# EAGLE design master-board plus slave (EAGLE 9.1.3)
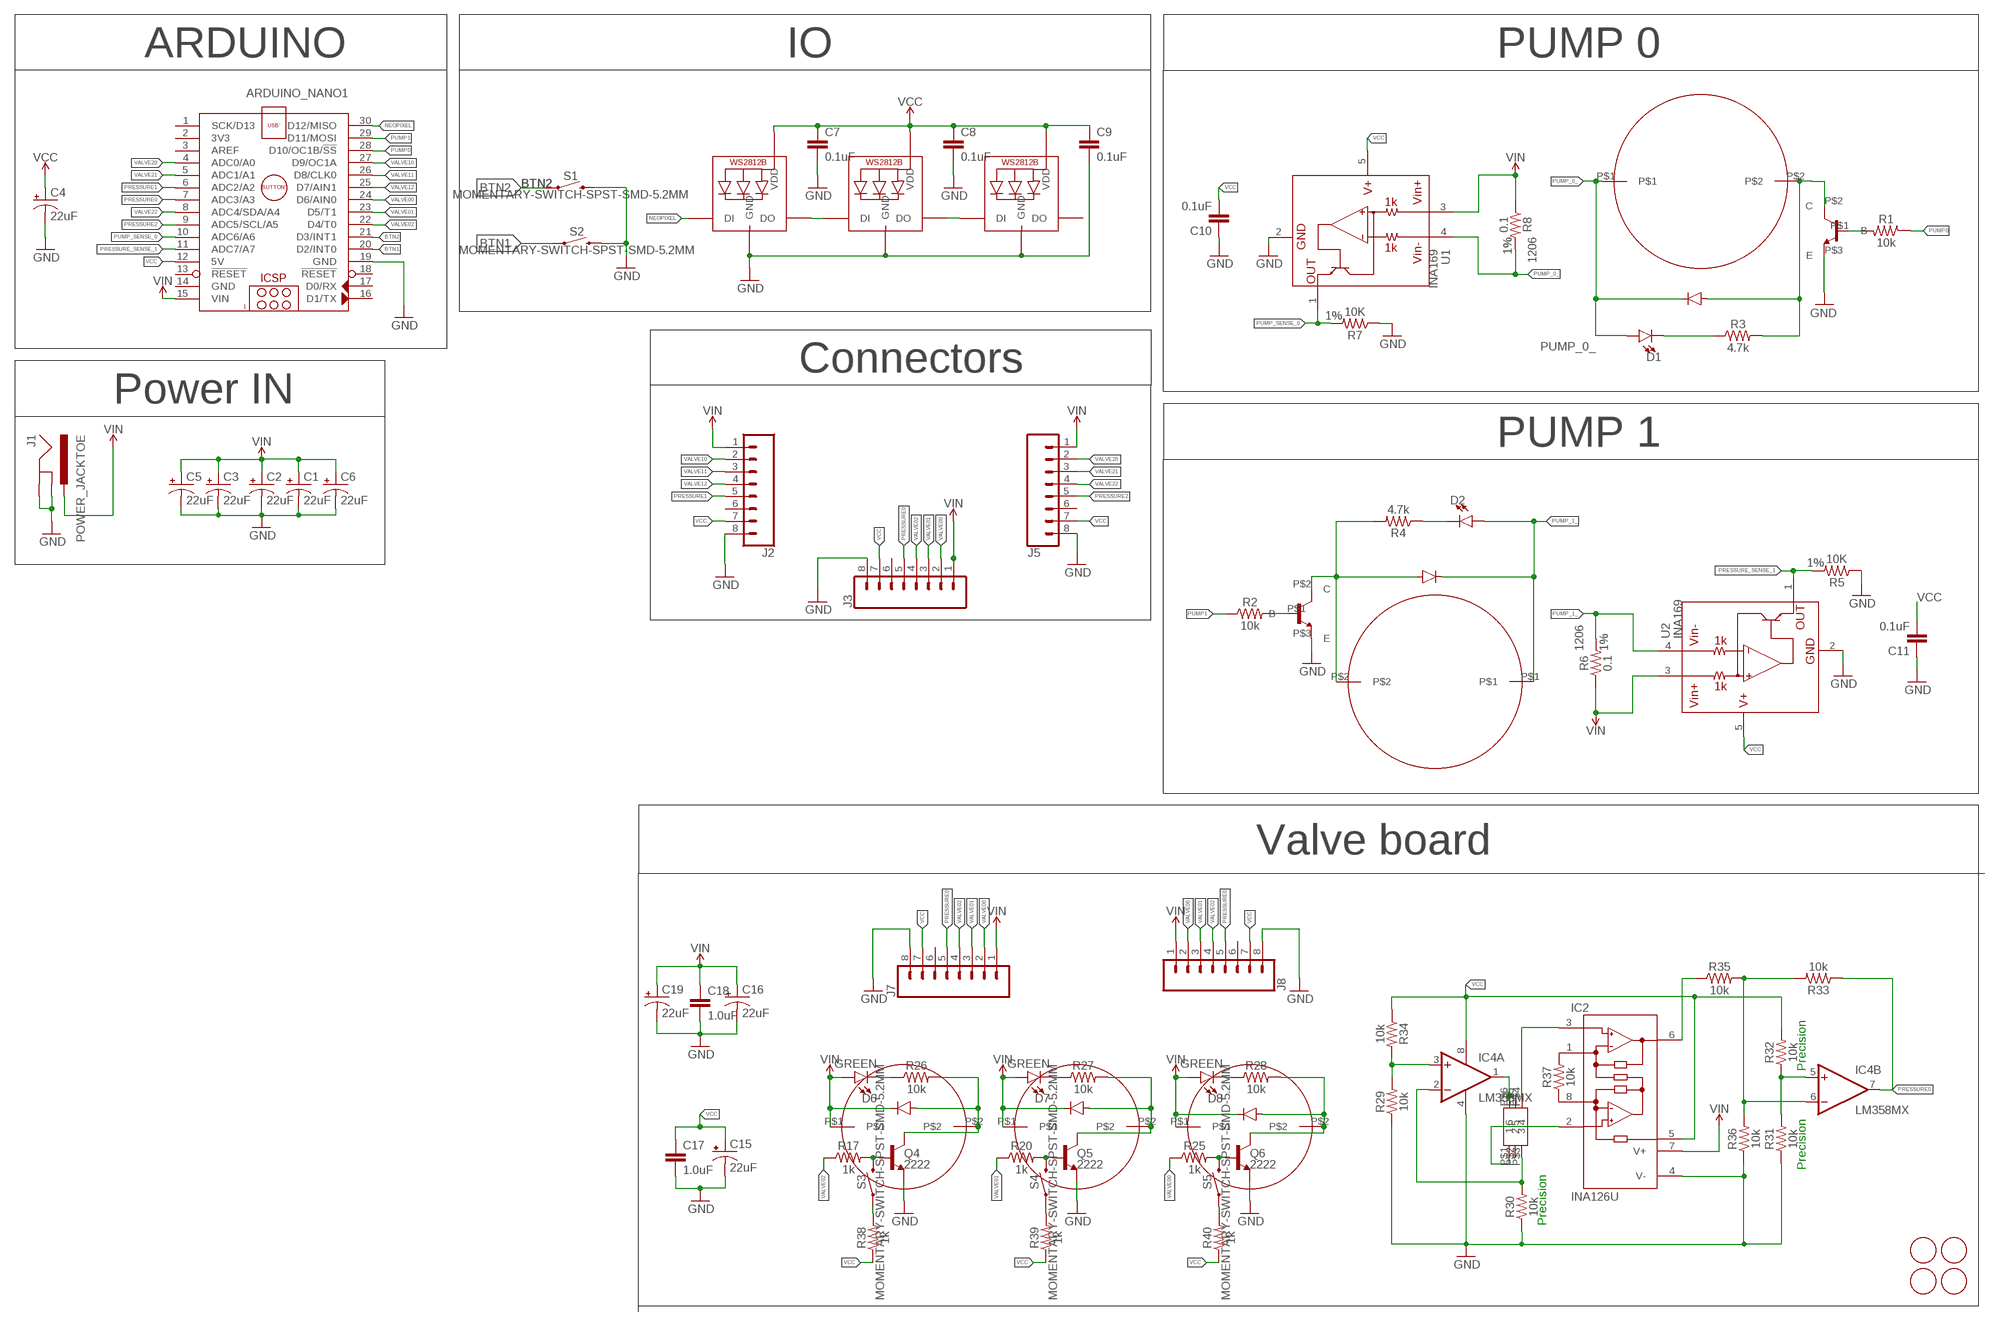
[diagram p0: schematic, sheet 1]

## Parts
ARDUINO_NANO1  ARDUINO_NANO  [ARDUINO_NANO]
C1  22uF  22UF-POLAR-PANASONIC_C-35V-20%  [PANASONIC_C]
C2  22uF  22UF-POLAR-PANASONIC_C-35V-20%  [PANASONIC_C]
C3  22uF  22UF-POLAR-PANASONIC_C-35V-20%  [PANASONIC_C]
C4  22uF  22UF-POLAR-PANASONIC_C-35V-20%  [PANASONIC_C]
C5  22uF  22UF-POLAR-PANASONIC_C-35V-20%  [PANASONIC_C]
C6  22uF  22UF-POLAR-PANASONIC_C-35V-20%  [PANASONIC_C]
C7  0.1uF  0.1UF-0603-25V-(+80/-20%)  [0603]
C8  0.1uF  0.1UF-0603-25V-(+80/-20%)  [0603]
C9  0.1uF  0.1UF-0603-25V-(+80/-20%)  [0603]
C10  0.1uF  CAP0603-CAP  [0603-CAP]
C11  0.1uF  CAP0603-CAP  [0603-CAP]
C15  22uF  22UF-POLAR-PANASONIC_C-35V-20%  [PANASONIC_C]
C16  22uF  22UF-POLAR-PANASONIC_C-35V-20%  [PANASONIC_C]
C17  1.0uF  1.0UF-0603-16V-10%  [0603]
C18  1.0uF  1.0UF-0603-16V-10%  [0603]
C19  22uF  22UF-POLAR-PANASONIC_C-35V-20%  [PANASONIC_C]
D1  LED0603  [LED-0603]
D2  LED0603  [LED-0603]
D6  GREEN  LED-GREEN0603  [LED-0603]
D7  GREEN  LED-GREEN0603  [LED-0603]
D8  GREEN  LED-GREEN0603  [LED-0603]
IC2  INA126U  [SO08]
IC4  LM358MX  [SO08]
J1  POWER_JACKTOE  [POWER_JACK_SMD_OVERPASTE_TOE]
J2  CONN_08FLIPPED  [1X08]
J3  CONN_08"  [1X08]
J5  CONN_081X08_FEMALE_FLIPPED  [1X08_FEMALE_FLIPPED]
J7  CONN_08  [1X08_MALE_FLIPPED]
J8  CONN_08NO_SILK_FEMALE_PTH  [1X08_NO_SILK]
LED1  WS2812B5050  [WS2812B]
LED2  WS2812B5050  [WS2812B]
LED3  WS2812B5050  [WS2812B]
Q4  2222  TRANS_NPN-MMBT2222AL  [SOT23-3]
Q5  2222  TRANS_NPN-MMBT2222AL  [SOT23-3]
Q6  2222  TRANS_NPN-MMBT2222AL  [SOT23-3]
R1  10k  10KOHM-0603-1/10W-1%  [0603]
R2  10k  10KOHM-0603-1/10W-1%  [0603]
R3  4.7k  4.7KOHM-0603-1/10W-1%  [0603]
R4  4.7k  4.7KOHM-0603-1/10W-1%  [0603]
R5  10K  RESISTOR0603  [0603]
R6  0.1  RESISTOR1206  [1206]
R7  10K  RESISTOR0603  [0603]
R8  0.1  RESISTOR1206  [1206]
R17  1k  1KOHM-0603-1/10W-1%  [0603]
R20  1k  1KOHM-0603-1/10W-1%  [0603]
R25  1k  1KOHM-0603-1/10W-1%  [0603]
R26  10k  10KOHM-0603-1/10W-1%  [0603]
R27  10k  10KOHM-0603-1/10W-1%  [0603]
R28  10k  10KOHM-0603-1/10W-1%  [0603]
R29  10k  10KOHM-0603-1/10W-1%  [0603]
R30  10k  10KOHM-0603-1/10W-1%  [0603]
R31  10k  10KOHM-0603-1/10W-1%  [0603]
R32  10k  10KOHM-0603-1/10W-1%  [0603]
R33  10k  10KOHM-0603-1/10W-1%  [0603]
R34  10k  10KOHM-0603-1/10W-1%  [0603]
R35  10k  10KOHM-0603-1/10W-1%  [0603]
R36  10k  10KOHM-0603-1/10W-1%  [0603]
R37  10k  10KOHM-0603-1/10W-1%  [0603]
R38  1k  1KOHM-0603-1/10W-1%  [0603]
R39  1k  1KOHM-0603-1/10W-1%  [0603]
R40  1k  1KOHM-0603-1/10W-1%  [0603]
S1  MOMENTARY-SWITCH-SPST-SMD-5.2MM  [TACTILE_SWITCH_SMD_5.2MM]
S2  MOMENTARY-SWITCH-SPST-SMD-5.2MM  [TACTILE_SWITCH_SMD_5.2MM]
S3  MOMENTARY-SWITCH-SPST-SMD-5.2MM  [TACTILE_SWITCH_SMD_5.2MM]
S4  MOMENTARY-SWITCH-SPST-SMD-5.2MM  [TACTILE_SWITCH_SMD_5.2MM]
S5  MOMENTARY-SWITCH-SPST-SMD-5.2MM  [TACTILE_SWITCH_SMD_5.2MM]
U1  INA169  [SOT23-5]
U2  INA169  [SOT23-5]
U$1  AIYIMA-PUMP-A5F083  [A5F083]
U$2  AIYIMA-PUMP-A5F083  [A5F083]
U$3  IN4148  [IN4148]
U$4  IN4148  [IN4148]
U$5  TIP120-TO220  [TO220]
U$6  TIP120-TO220  [TO220]
U$9  FIDUCIAL  [FIDUCIAL_1MM]
U$10  FIDUCIAL  [FIDUCIAL_1MM]
U$11  FIDUCIAL  [FIDUCIAL_1MM]
U$12  FIDUCIAL  [FIDUCIAL_1MM]
U$17  CJV23-SOLENOID-VALVE  [CJV23]
U$18  CJV23-SOLENOID-VALVE  [CJV23]
U$19  CJV23-SOLENOID-VALVE  [CJV23]
U$20  IN4148  [IN4148]
U$21  IN4148  [IN4148]
U$22  IN4148  [IN4148]
U$23  2SMPP-03  [2SMPP-03]

## Nets
BTN1: ARDUINO_NANO1.20(D2/INT0) S2.1
BTN2: ARDUINO_NANO1.21(D3/INT1) S1.1
GND: ARDUINO_NANO1.19(GND) C1.- C2.- C3.- C4.- C5.- C6.- C7.2 C8.2 C9.2 C10.1 C11.1 C15.- C16.- C17.2 C18.2 C19.- IC2.4(V-) IC4.4(P:V-) J1.GND(GNDBREAK) J1.P$4(GND) J2.8 J3.8 J5.8 J7.8 J8.8 LED1.3-GND(GND) LED2.3-GND(GND) LED3.3-GND(GND) Q4.2(E) Q5.2(E) Q6.2(E) R5.1 R7.1 R29.1 R30.1 R31.1 R36.1 S1.3 S2.3 U1.2(GND) U2.2(GND) U$5.P$3(E) U$6.P$3(E)
N$2: R1.2 U$6.P$1(B)
N$5: R3.2 U$1.P$2 U$3.P$2 U$6.P$2(C)
N$6: R4.2 U$2.P$2 U$4.P$2 U$5.P$2(C)
N$7: R2.2 U$5.P$1(B)
N$12: D1.C R3.1
N$17: D2.C R4.1
N$21: LED2.2-DOUT(DO) LED3.4-DIN(DI)
N$26: LED1.2-DOUT(DO) LED2.4-DIN(DI)
N$54: Q4.1(B) R17.2 S3.3
N$55: Q5.1(B) R20.2 S4.3
N$56: Q6.1(B) R25.2 S5.3
N$57: Q6.3(C) R28.2 U$19.P$2 U$22.P$2
N$58: Q5.3(C) R27.2 U$18.P$2 U$21.P$2
N$59: Q4.3(C) R26.2 U$17.P$2 U$20.P$2
N$65: D8.C R28.1
N$66: D7.C R27.1
N$67: D6.C R26.1
N$68: IC2.2(-IN) U$23.P$1
N$69: IC4.1(A:OUT) U$23.P$5 U$23.P$6
N$70: IC2.3(+IN) U$23.P$4
N$71: IC4.3(A:+IN) R29.2 R34.2
N$72: IC2.8(RG) R37.1
N$73: IC2.1(RG) R37.2
N$74: IC4.6(B:-IN) R33.2 R35.2 R36.2
N$75: IC4.5(B:+IN) R31.2 R32.1
N$76: IC4.2(A:-IN) R30.2 U$23.P$3
N$77: IC2.6(OUT) R35.1
N$78: R38.2 S3.1
N$79: R39.2 S4.1
N$80: R40.2 S5.1
NEOPIXEL: ARDUINO_NANO1.30(D12/MISO) LED1.4-DIN(DI)
PRESSURE0: ARDUINO_NANO1.7(ADC3/A3) IC4.7(B:OUT) J3.5 J7.5 J8.5 R33.1
PRESSURE1: ARDUINO_NANO1.6(ADC2/A2) J2.5
PRESSURE2: ARDUINO_NANO1.9(ADC5/SCL/A5) J5.5
PRESSURE_SENSE_1: ARDUINO_NANO1.11(ADC7/A7) R5.2 U2.1(OUT)
PUMP0: ARDUINO_NANO1.28(D10/OC1B/!SS) R1.1
PUMP1: ARDUINO_NANO1.29(D11/MOSI) R2.1
PUMP_0_: D1.A R8.2 U1.4(VIN-) U$1.P$1 U$3.P$1
PUMP_1_: D2.A R6.2 U2.4(VIN-) U$2.P$1 U$4.P$1
PUMP_SENSE_0: ARDUINO_NANO1.10(ADC6/A6) R7.2 U1.1(OUT)
VALVE00: ARDUINO_NANO1.24(D6/AIN0) J3.2 J7.2 J8.2 R25.1
VALVE01: ARDUINO_NANO1.23(D5/T1) J3.3 J7.3 J8.3 R20.1
VALVE02: ARDUINO_NANO1.22(D4/T0) J3.4 J7.4 J8.4 R17.1
VALVE10: ARDUINO_NANO1.27(D9/OC1A) J2.2
VALVE11: ARDUINO_NANO1.26(D8/CLK0) J2.3
VALVE12: ARDUINO_NANO1.25(D7/AIN1) J2.4
VALVE20: ARDUINO_NANO1.4(ADC0/A0) J5.2
VALVE21: ARDUINO_NANO1.5(ADC1/A1) J5.3
VALVE22: ARDUINO_NANO1.8(ADC4/SDA/A4) J5.4
VCC: ARDUINO_NANO1.12(5V) C4.+ C7.1 C8.1 C9.1 C10.2 C11.2 C15.+ C17.1 IC2.5(REF) IC4.8(P:V+) J2.7 J3.7 J5.7 J7.7 J8.7 LED1.1-VDD(VDD) LED2.1-VDD(VDD) LED3.1-VDD(VDD) R32.2 R34.1 R38.1 R39.1 R40.1 U1.5(V+) U2.5(V+)
VIN: ARDUINO_NANO1.15(VIN) C1.+ C2.+ C3.+ C5.+ C6.+ C16.+ C18.1 C19.+ D6.A D7.A D8.A IC2.7(V+) J1.VIN0(PWR) J2.1 J3.1 J5.1 J7.1 J8.1 R6.1 R8.1 U1.3(VIN+) U2.3(VIN+) U$17.P$1 U$18.P$1 U$19.P$1 U$20.P$1 U$21.P$1 U$22.P$1
Unconnected: ARDUINO_NANO1.1(SCK/D13) ARDUINO_NANO1.2(3V3) ARDUINO_NANO1.3(AREF) ARDUINO_NANO1.13(!RESET) ARDUINO_NANO1.16(D1/TX) ARDUINO_NANO1.17(D0/RX) ARDUINO_NANO1.18(!RESET) J2.6 J3.6 J5.6 J7.6 J8.6 LED3.2-DOUT(DO) U$23.P$2

## Notes on the sheet
- ARDUINO | IO | PUMP 0
- Connectors
- Power IN
- PUMP 1
- Valve board
- Precision
- Precision
- Precision

## Power pins joined to a net without a drawn wire
GND: ARDUINO_NANO1.14(GND)

## Library data of the parts
ARDUINO_NANO1 = master-board plus slave:ARDUINO_NANO: Arduino Nano V3.0 Module Overview: The Arduino Nano is a small, complete, and breadboard-friendly board based on the ATmega328 (Arduino Nano 3.x) or ATmega168 (Arduino Nano 2.x). It has more or less the same functionality of the Arduino Duemilanove, but in a different package. It lacks only a DC power jack, and works with a Mini-B USB cable instead of a standard one. The Nano was designed and is being produced by Gravitech <http://www.gravitech.us/arna30wiatp.html>. General specifications: Item Value Microcontroller Atmel ATmega168 or ATmega328 Operating Voltage (logic level) 5 V Input Voltage (recommended) 7-12 V Input Voltage (limits) 6-20 V Digital I/O Pins 14 (of which 6 provide PWM output) Analog Input Pins 8 DC Current per I/O Pin 40 mA Flash Memory 16 KB (ATmega168) or 32 KB (ATmega328) of which 2 KB used by bootloader SRAM 1 KB (ATmega168) or 2 KB (ATmega328) EEPROM 512 bytes (ATmega168) or 1 KB (ATmega328) Clock Speed 16 MHz Dimensions (Inches) 0.73" x 1.70" Dimensions (mm) 18mm x 45mm Overall height About 9 mm (not including pins) Weigth 5 g Power: The Arduino Nano can be powered via the Mini-B USB connection, 6-20V unregulated external power supply (pin 30), or 5V regulated external power supply (pin 27). The power source is automatically selected to the highest voltage source. Memory: The ATmega168 has 16 KB of flash memory for storing code (of which 2 KB is used for the bootloader); the ATmega328 has 32 KB, (also with 2 KB used for the bootloader). The ATmega168 has 1 KB of SRAM and 512 bytes of EEPROM (which can be read and written with the EEPROM library); the ATmega328 has 2 KB of SRAM and 1 KB of EEPROM. Input and Output: Each of the 14 digital pins on the Nano can be used as an input or output, using pinMode(), digitalWrite(), and digitalRead() functions. They operate at 5 volts. Each pin can provide or receive a maximum of 40 mA and has an internal pull-up resistor (disconnected by default) of 20-50 kOhms. In addition, some pins have specialized functions. Visit Arduino - ArduinoBoardNano <https://www.arduino.cc/en/Main/ArduinoBoardNano>
C1-C6 C15 C16 C19 = master-board plus slave:22UF-POLAR: 22µF polarized capacitors A capacitor is a passive two-terminal electrical component used to store electrical energy temporarily in an electric field.; PROD_ID: CAP-08618
C7-C9 = master-board plus slave:0.1UF: 0.1µF ceramic capacitors A capacitor is a passive two-terminal electrical component used to store electrical energy temporarily in an electric field.; PROD_ID: CAP-00810
C10 C11 = master-board plus slave:CAP: Capacitor Standard 0603 ceramic capacitor, and 0.1" leaded capacitor.
C17 C18 = master-board plus slave:1.0UF: 1µF ceramic capacitors A capacitor is a passive two-terminal electrical component used to store electrical energy temporarily in an electric field.; PROD_ID: CAP-00868
D1 D2 = master-board plus slave:LED: LED (Generic) Standard schematic elements and footprints for 5mm, 3mm, 1206, and 0603 sized LEDs. Generic LEDs with no color specified.
D6-D8 = master-board plus slave:LED-GREEN: Green SMD LED Used in manufacturing of various products at SparkFun Packages: 0603 - SMD 0603 package [Product Link] <http://www.futureelectronics.com/en/technologies/semiconductors/optoelectronics/leds/Pages/9894312-LTST-C190GKT.aspx?CrossPart=HSMG-C190&IM=0> LilyPad 1206 - SMD1206 LilyPad package [Product Link] <http://www.futureelectronics.com/en/Technologies/Product.aspx?ProductID=IN150NGHARVATEKCORPORATION2049943&IM=0> 1206 - SMD1206 package [Product Link] <http://www.futureelectronics.com/en/technologies/semiconductors/optoelectronics/leds/Pages/8315665-LTST-C150KGKT.aspx?IM=0> 1206 Bottom Mount -SMD 1206 Bottom Mount [Product Link] <http://www.digikey.com/product-detail/en/lite-on-inc/LTST-C230KGKT/160-1456-1-ND/386854> SparkFun Products: Pro Mini 328 -5V <https://www.sparkfun.com/products/821> RedBoard <https://www.sparkfun.com/products/12757> MP3 Trigger <https://www.sparkfun.com/products/13720> Makey Makey <https://www.sparkfun.com/products/11076>; PROD_ID: DIO-00821
IC2 = master-board plus slave:INA126: Instrumentation Amplifier Micropower, Single and Dual Versions; AVAILABILITY: Unavailable; DESCRIPTION: the ina126 and ina2126 are precision instrumentation amplifiers for accurate low noise differential signal acquisitio...; MF: Texas Instruments; MP: INA126; PACKAGE: TSSOP-8 Texas Instruments; PRICE: None
IC4 = master-board plus slave:LM358: OP AMP also LM158; LM258; LM2904 Source: http://cache.national.com/ds/LM/LM158.pdf
J1 = master-board plus slave:POWER_JACK: Power Jack Connector This is the standard 5.5mm barrel jack for power. The PTH is the most common, proven, reliable, footprint. The Slot footprint only works if the mill layer is transmitted to the PCB fab house so be warned. Here are the connectors we sell at SparkFun: DC Barrel Power Jack/Connector <https://www.sparkfun.com/products/119> (PRT-00119) DC Barrel Power Jack/Connector (SMD) <https://www.sparkfun.com/products/12748> (PRT-12748) DC Barrel Jack Adapter - Breadboard Compatible <https://www.sparkfun.com/products/10811> (PRT-10811) It is used on this SparkFun product (and many, many others): SparkFun RedBoard - Programmed with Arduino <https://www.sparkfun.com/products/12757> (DEV-12757) Also, if you need a mating power supply or connector, please check these out: Wall Adapter Power Supply - 9VDC 650mA <https://www.sparkfun.com/products/298> (TOL-00298) DC Barrel Jack Adapter - Male <https://www.sparkfun.com/products/10287> (PRT-10287); PROD_ID: CONN-08106; SF_ID: PRT-12748
J2 J5 J7 = master-board plus slave:CONN_08: Multi connection point. Often used as Generic Header-pin footprint for 0.1 inch spaced/style header connections On any of the 0.1 inch spaced packages, you can populate with these: Break Away Headers - Straight <https://www.sparkfun.com/products/116> (PRT-00116) Break Away Male Headers - Right Angle <https://www.sparkfun.com/products/553> (PRT-00553) Female Headers <https://www.sparkfun.com/products/115> (PRT-00115) Break Away Headers - Machine Pin <https://www.sparkfun.com/products/117> (PRT-00117) Break Away Female Headers - Swiss Machine Pin <https://www.sparkfun.com/products/743> (PRT-00743) Arduino Stackable Header - 8 Pin <https://www.sparkfun.com/products/9279> (PRT-09279) For SCREWTERMINALS and SPRING TERMINALS visit here: Screw Terimnals on SparkFun.com <https://www.sparkfun.com/search/results?term=Screw+Terminals> (5mm/3.5mm/2.54mm spacing) This device is also useful as a general connection point to wire up your design to another part of your project. Our various solder wires solder well into these plated through hole pads. Hook-Up Wire - Assortment (Stranded, 22 AWG) <https://www.sparkfun.com/products/11375> (PRT-11375) Hook-Up Wire - Assortment (Solid Core, 22 AWG) <https://www.sparkfun.com/products/11367> (PRT-11367) View the entire wire category on our website here <https://www.sparkfun.com/categories/141> Special notes: Molex polarized connector foot print use with SKU : PRT-08231 with associated crimp pins and housings. 1MM SMD Version SKU: PRT-10208 NOTES ON THE VARIANTS LOCK and LOCK_LONGPADS... This footprint was designed to help hold the alignment of a through-hole component (i.e. 6-pin header) while soldering it into place. You may notice that each hole has been shifted either up or down by 0.005 of an inch from it's more standard position (which is a perfectly straight line). This slight alteration caused the pins (the squares in the middle) to touch the edges of the holes. Because they are alternating, it causes a "brace" to hold the component in place. 0.005 has proven to be the perfect amount of "off-center" position when using our standard breakaway headers. Although looks a little odd when you look at the bare footprint, once you have a header in there, the alteration is very hard to notice. Also,if you push a header all the way into place, it is covered up entirely on the bottom side.
J3 J8 = master-board plus slave:CONN_08: Multi connection point. Often used as Generic Header-pin footprint for 0.1 inch spaced/style header connections On any of the 0.1 inch spaced packages, you can populate with these: Break Away Headers - Straight <https://www.sparkfun.com/products/116> (PRT-00116) Break Away Male Headers - Right Angle <https://www.sparkfun.com/products/553> (PRT-00553) Female Headers <https://www.sparkfun.com/products/115> (PRT-00115) Break Away Headers - Machine Pin <https://www.sparkfun.com/products/117> (PRT-00117) Break Away Female Headers - Swiss Machine Pin <https://www.sparkfun.com/products/743> (PRT-00743) Arduino Stackable Header - 8 Pin <https://www.sparkfun.com/products/9279> (PRT-09279) For SCREWTERMINALS and SPRING TERMINALS visit here: Screw Terimnals on SparkFun.com <https://www.sparkfun.com/search/results?term=Screw+Terminals> (5mm/3.5mm/2.54mm spacing) This device is also useful as a general connection point to wire up your design to another part of your project. Our various solder wires solder well into these plated through hole pads. Hook-Up Wire - Assortment (Stranded, 22 AWG) <https://www.sparkfun.com/products/11375> (PRT-11375) Hook-Up Wire - Assortment (Solid Core, 22 AWG) <https://www.sparkfun.com/products/11367> (PRT-11367) View the entire wire category on our website here <https://www.sparkfun.com/categories/141> Special notes: Molex polarized connector foot print use with SKU : PRT-08231 with associated crimp pins and housings. 1MM SMD Version SKU: PRT-10208 NOTES ON THE VARIANTS LOCK and LOCK_LONGPADS... This footprint was designed to help hold the alignment of a through-hole component (i.e. 6-pin header) while soldering it into place. You may notice that each hole has been shifted either up or down by 0.005 of an inch from it's more standard position (which is a perfectly straight line). This slight alteration caused the pins (the squares in the middle) to touch the edges of the holes. Because they are alternating, it causes a "brace" to hold the component in place. 0.005 has proven to be the perfect amount of "off-center" position when using our standard breakaway headers. Although looks a little odd when you look at the bare footprint, once you have a header in there, the alteration is very hard to notice. Also,if you push a header all the way into place, it is covered up entirely on the bottom side.; PROD_ID: CONN-08438
LED1-LED3 = master-board plus slave:WS2812B
Q4-Q6 = master-board plus slave:TRANS_NPN: NPN transistor Current controlled devices typically used to amplify current or used as a switch. BC547 - COM-08928 <http://www.sparkfun.com/products/8928> (TO-92 45V 100mA) (1.Collector 2.Base 3.Emitter) 2N3904 - COM-00521 <http://www.sparkfun.com/products/521> (TO-92 40V 200mA) (1.Emitter 2.Base 3.Collector) P2N2222A - COM-12852 <http://www.sparkfun.com/products/12852> (TO-92 40V 600mA) (1.Collector 2.Base 3.Emitter); PROD_ID: TRANS-08049; VALUE: 600mA/40V
R1 R2 R26-R37 = master-board plus slave:10KOHM: 10kΩ resistor A resistor is a passive two-terminal electrical component that implements electrical resistance as a circuit element. Resistors act to reduce current flow, and, at the same time, act to lower voltage levels within circuits. - Wikipedia; PROD_ID: RES-00824
R3 R4 = master-board plus slave:4.7KOHM: 4.7kΩ resistor A resistor is a passive two-terminal electrical component that implements electrical resistance as a circuit element. Resistors act to reduce current flow, and, at the same time, act to lower voltage levels within circuits. - Wikipedia; PROD_ID: RES-07857
R5 R7 = master-board plus slave:RESISTOR; TOL: 1%
R6 R8 = master-board plus slave:RESISTOR; SIZE: 1206; TOL: 1%
R17 R20 R25 R38-R40 = master-board plus slave:1KOHM: 1kΩ resistor A resistor is a passive two-terminal electrical component that implements electrical resistance as a circuit element. Resistors act to reduce current flow, and, at the same time, act to lower voltage levels within circuits. - Wikipedia; PROD_ID: RES-07856
S1-S5 = master-board plus slave:MOMENTARY-SWITCH-SPST: Momentary Switch (Pushbutton) - SPST Normally-open (NO) SPST momentary switches (buttons, pushbuttons). Variants PTH-12MM - 12mm square, through-hole Momentary Pushbutton Switch - 12mm Square <https://www.sparkfun.com/products/9190> (COM-09190) PTH-6.0MM, PTH-6.0MM-KIT - 6.0mm square, through-hole Mini Pushbutton Switch <https://www.sparkfun.com/products/97> (COM-00097) KIT package intended for soldering kit's - only one side of pads' copper is exposed. PTH-RIGHT-ANGLE-KIT - Right-angle, through-hole Right Angle Tactile Button <https://www.sparkfun.com/products/10791> - Used on SparkFun BigTime Watch Kit <https://www.sparkfun.com/products/11734> SMD-12MM - 12mm square, surface-mount Tactile Button - SMD (12mm) <https://www.sparkfun.com/products/12993> (COM-12993) Used on SparkFun PicoBoard <https://www.sparkfun.com/products/11888> SMD-4.5MM - 4.5mm Square Trackball Switch Used on SparkFun Blackberry Trackballer Breakout <https://www.sparkfun.com/products/13169> SMD-4.6MMX2.8MM - 4.60mm x 2.80mm, surface mount Used on SparkFun SAMD21 Mini Breakout <https://www.sparkfun.com/products/13664> SMD-5.2MM, SMD-5.2-REDUNDANT - 5.2mm square, surface-mount Mini Pushbutton Switch - SMD <https://www.sparkfun.com/products/8720> (COM-08720) Used on Arduino Pro Mini <https://www.sparkfun.com/products/11114> REDUNDANT package connects both switch circuits together SMD-6.0X3.5MM - 6.0 x 3.5mm, surface mount Momentary Reset Switch SMD <https://www.sparkfun.com/products/8229> (COM-08229) SMD-6.2MM-TALL - 6.2mm square, surface mount Tactile Button - SMD (6mm) <https://www.sparkfun.com/products/12992> Used on SparkFun Digital Sandbox <https://www.sparkfun.com/products/12651> SMD-RIGHT-ANGLE - Right-angle, surface mount Used on SparkFun Block for Intel® Edison - Arduino <https://www.sparkfun.com/products/13036>; PROD_ID: SWCH-08247; SF_SKU: COM-08720
U1 U2 = master-board plus slave:INA169
U$1 U$2 = master-board plus slave:AIYIMA-PUMP-A5F083: Aiyima company vacuum/high pressure air pump. 12V, 0.35A, 3LPM
U$3 U$4 U$20-U$22 = master-board plus slave:IN4148
U$5 U$6 = master-board plus slave:TIP120-TO220
U$9-U$12 = master-board plus slave:FIDUCIAL: For use by pick and place machines to calibrate the vision/machine, 1mm By microbuilder.eu
U$17-U$19 = master-board plus slave:CJV23-SOLENOID-VALVE: CJV23 solenoid valve
U$23 = master-board plus slave:2SMPP-03

## Board
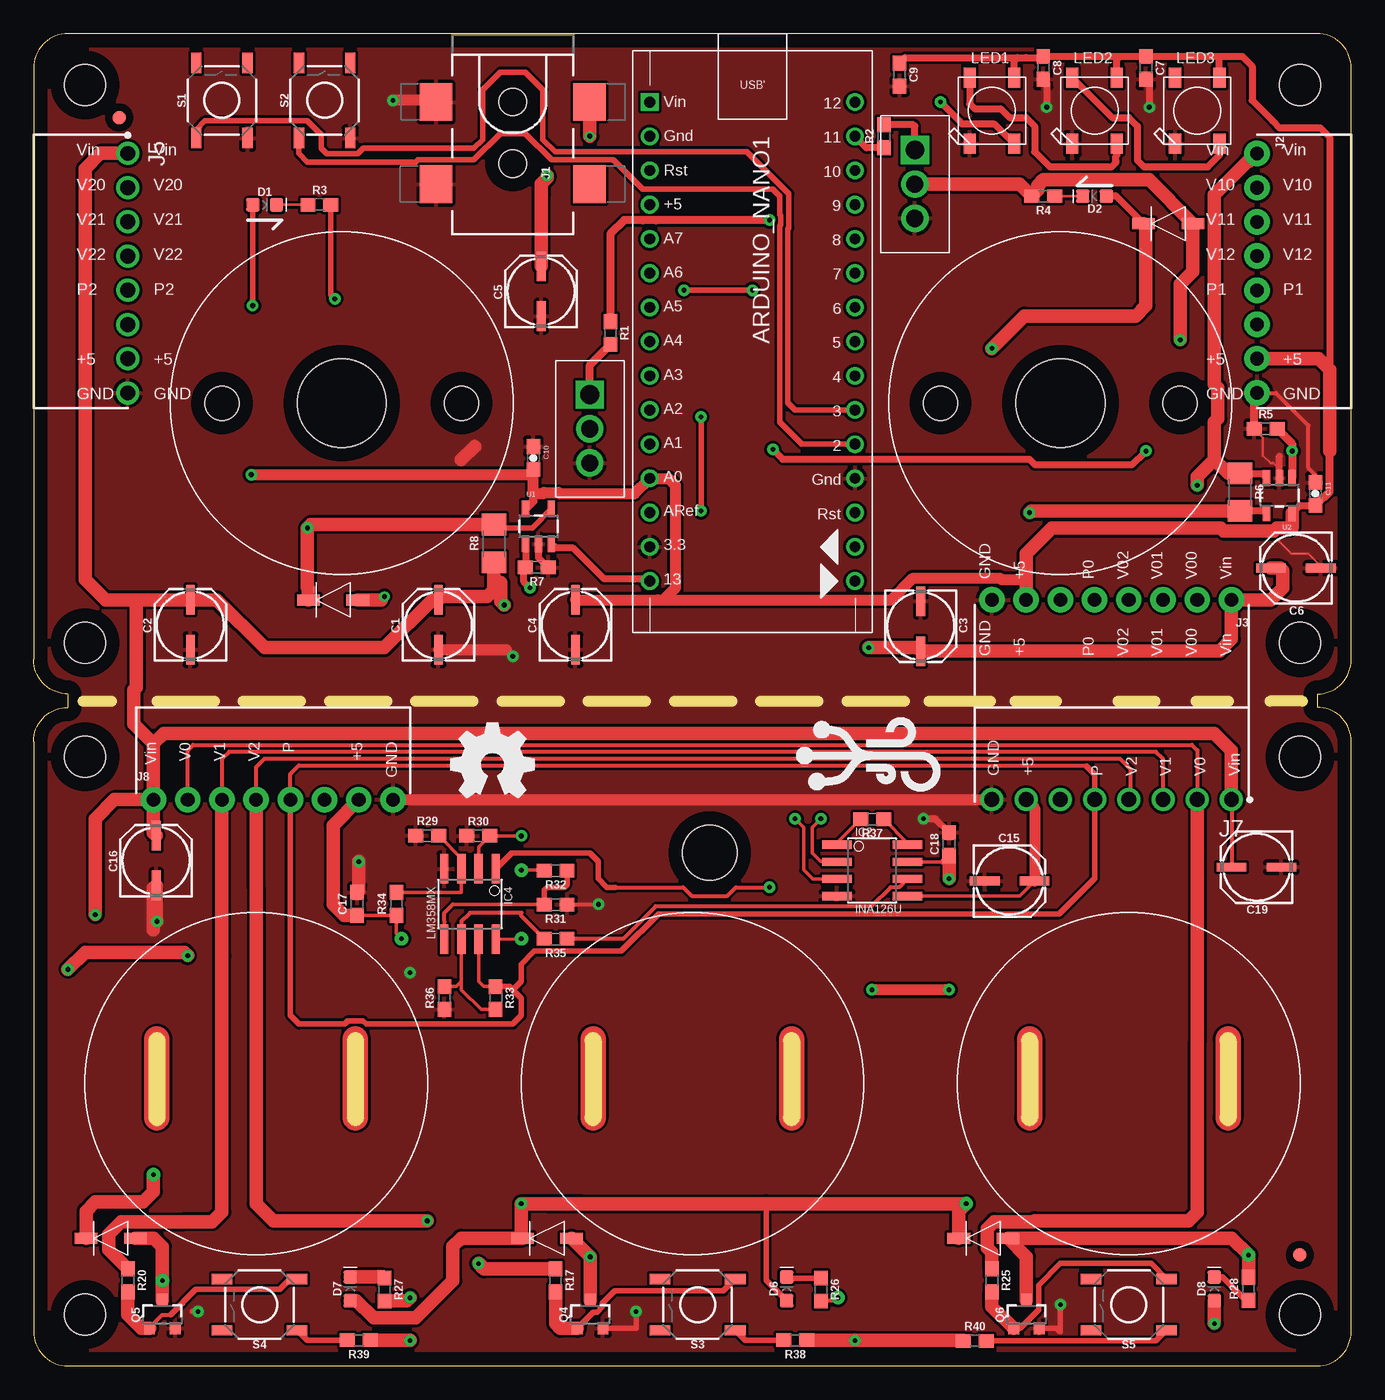
[diagram p1: board, top side]
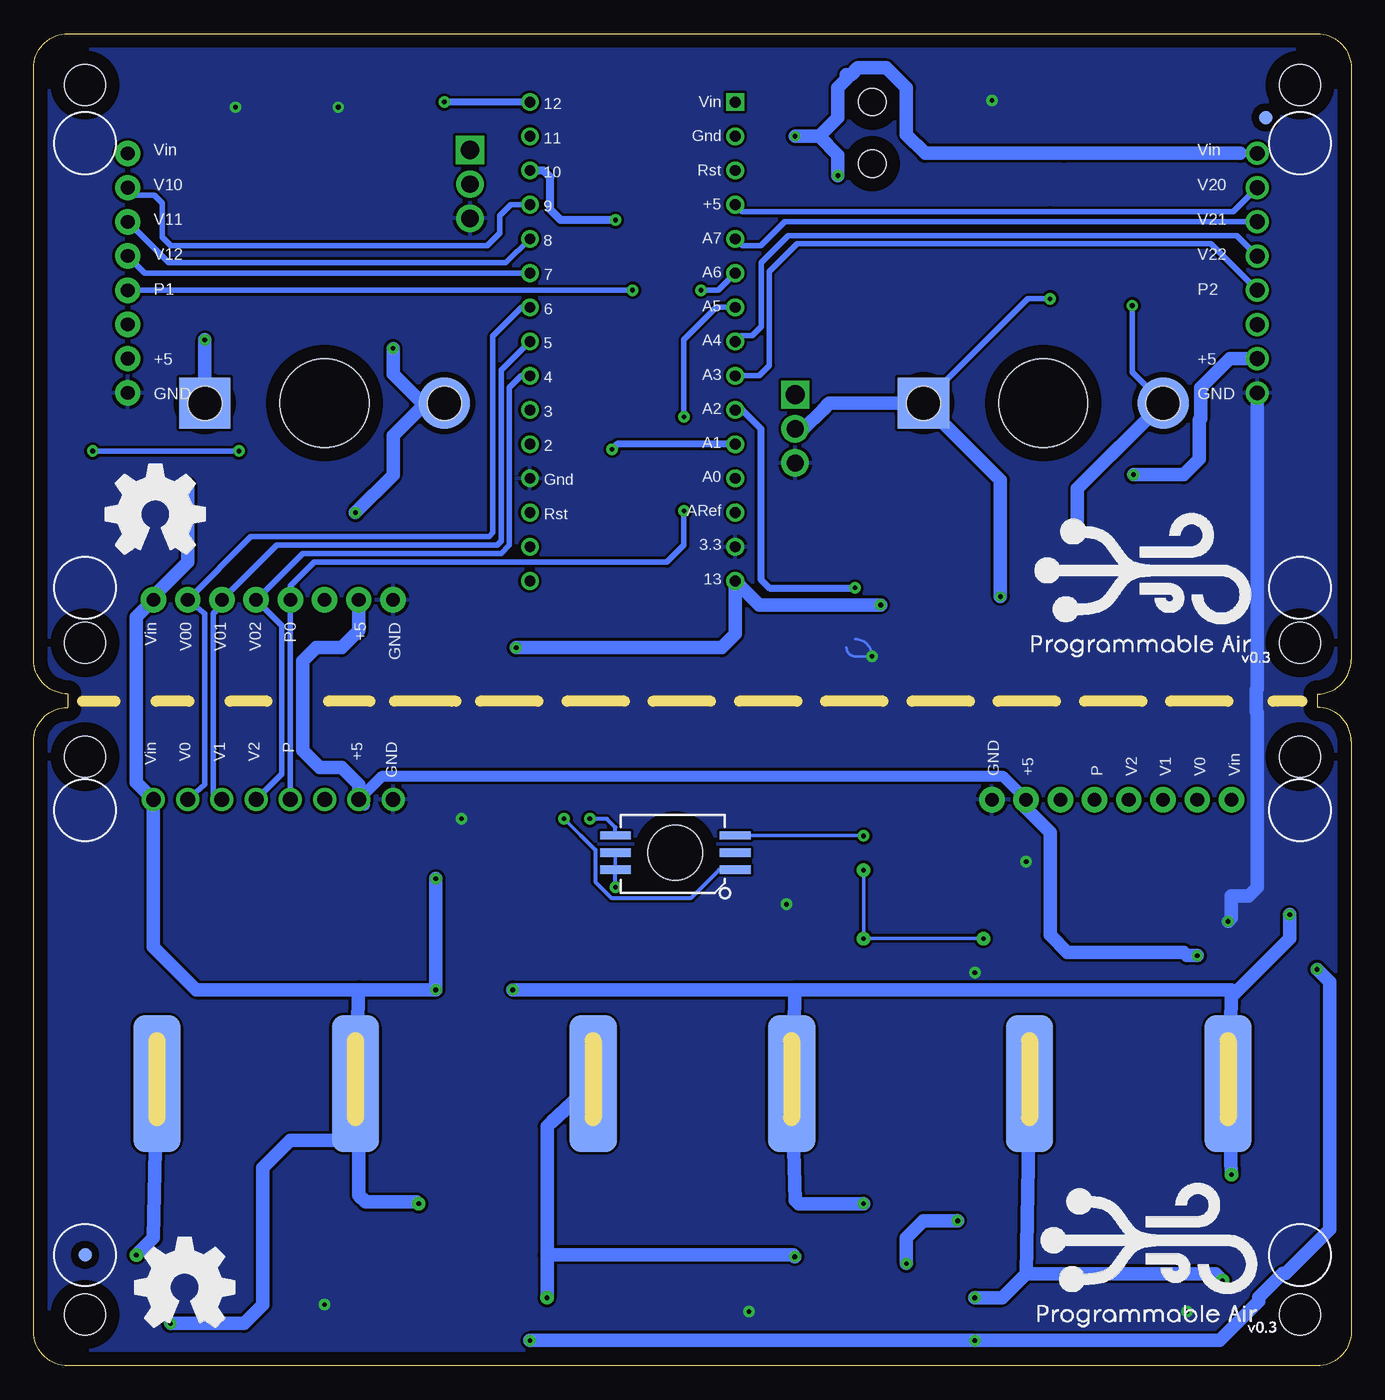
[diagram p2: board, bottom side, seen from below]

Size 97.79 x 98.91 mm. Coordinates in mm from the lower left corner, seen from the top.
Outline: 2.54,49.89 arc-90 0,52.43 0,96.37 arc-90 2.54,98.91 95.25,98.91 arc-90 97.79,96.37 97.79,52.43 arc-90 95.25,49.89 95.25,48.89 arc-90 97.79,46.35 97.79,2.54 arc-90 95.25,0 2.54,0 arc-90 0,2.54 0,46.35 arc-90 2.54,48.89 2.54,49.89
Copper layers (1*16): Top 0.035mm / dielectric 1.5mm / Bottom 0.035mm
Design rules "default *": minimum track width 8mil, minimum drill 0.35mm, track to track 8mil, track to pad 8mil, pad to pad 8mil, via to via 8mil, smd to smd 8mil, copper to edge 40mil, drill to drill 6mil, minimum pad ring 10mil, minimum via ring 8mil, stop-mask expansion 4mil, vias tented up to drill 33mil, thermal gap 10mil
Holes 3.05 mm at 3.81,95.1 3.81,53.7 93.98,53.7 93.98,95.1 3.81,3.81 3.81,45.21 93.98,45.21 93.98,3.81
tKeepout: area 91.4,92.6 to 97.8,98.9; area 91.4,49.9 to 97.8,56.2; area 0,92.6 to 6.3,98.9; area 0,49.9 to 6.3,56.2; area 10.2,58.8 to 35.6,84.2; area 63.5,58.8 to 88.9,84.2; area 36.2,8.3 to 61.6,33.7; area 36.2,8.3 to 61.6,33.7; area 3.8,8.3 to 29.2,33.7; area 68.6,8.3 to 94,33.7; area 0,42.7 to 6.3,48.9; area 91.4,42.7 to 97.8,48.9; 2 more areas
bKeepout: area 0,49.9 to 6.3,56.2; area 0,92.6 to 6.3,98.9; area 91.4,92.6 to 97.8,98.9; area 91.4,49.9 to 97.8,56.2; area 0,42.7 to 6.3,48.9; area 91.4,42.7 to 97.8,48.9; area 91.4,0 to 97.8,6.3; area 0,0 to 6.3,6.3
Milling: 26 lines

### Footprints (pad centres in the part's own frame; a part is rotated, then mirrored left to right if it is on the bottom)
ARDUINO_NANO = drill 0.8 square: 1 -20.32,-7.62 | drill 0.8: 2 -17.78,-7.62; 3 -15.24,-7.62; 4 -12.7,-7.62; 5 -10.16,-7.62; 6 -7.62,-7.62; 7 -5.08,-7.62; 8 -2.54,-7.62; 9 0,-7.62; 10 2.54,-7.62; 11 5.08,-7.62; 12 7.62,-7.62; 13 10.16,-7.62; 14 12.7,-7.62; 15 15.24,-7.62; 16 15.24,7.62; 17 12.7,7.62; 18 10.16,7.62; 19 7.62,7.62; 20 5.08,7.62; 21 2.54,7.62; 22 0,7.62; 23 -2.54,7.62; 24 -5.08,7.62; 25 -7.62,7.62; 26 -10.16,7.62; 27 -12.7,7.62; 28 -15.24,7.62; 29 -17.78,7.62; 30 -20.32,7.62
PANASONIC_C = smd 2.2 x 0.65: + 1.9,-0.2; - -1.8,-0.2
0603 = smd 1.1 x 1: 1 -0.85,0; 2 0.85,0
0603-CAP = smd 1.1 x 1: 1 -0.85,0; 2 0.85,0
LED-0603 = smd 1 x 1: A -0.877,0; C 0.877,0
SO08 = smd 0.61 x 2.21: 1 -1.905,-2.616; 2 -0.635,-2.616; 3 0.635,-2.616; 4 1.905,-2.616; 5 1.905,2.616; 6 0.635,2.616; 7 -0.635,2.616; 8 -1.905,2.616
POWER_JACK_SMD_OVERPASTE_TOE = smd 2.8 x 2.4: GND 0,-5.7; P$4 6.1,-5.7; VIN0 0,5.7; VIN1 6.1,5.7 | hole 2.032: 0,0; 4.572,0
1X08 = drill 1.016 pad 1.88: 1 0,0; 2 2.54,0; 3 5.08,0; 4 7.62,0; 5 10.16,0; 6 12.7,0; 7 15.24,0; 8 17.78,0
1X08_FEMALE_FLIPPED = drill 1.105 pad 1.705: 1 0,0; 2 2.54,0; 3 5.08,0; 4 7.62,0; 5 10.16,0; 6 12.7,0; 7 15.24,0; 8 17.78,0
1X08_MALE_FLIPPED = drill 1.105 pad 1.705: 1 0,0; 2 2.54,0; 3 5.08,0; 4 7.62,0; 5 10.16,0; 6 12.7,0; 7 15.24,0; 8 17.78,0
1X08_NO_SILK = drill 1.016 pad 1.88: 1 0,0; 2 2.54,0; 3 5.08,0; 4 7.62,0; 5 10.16,0; 6 12.7,0; 7 15.24,0; 8 17.78,0
WS2812B = smd 1.5 x 0.9: 1-VDD 2.45,-1.65; 2-DOUT 2.45,1.65; 3-GND -2.45,1.65; 4-DIN -2.45,-1.65
SOT23-3 = smd 0.8 x 0.9: 1 -0.95,-1; 2 0.95,-1; 3 0,1.1
1206 = smd 1.6 x 1.8: 1 -1.4,0; 2 1.4,0
TACTILE_SWITCH_SMD_5.2MM = smd 1.524 x 0.762: 1 -2.794,1.905; 2 2.794,1.905; 3 -2.794,-1.905; 4 2.794,-1.905
SOT23-5 = smd 0.55 x 1.2: 1 -0.95,-1.3; 2 0,-1.3; 3 0.95,-1.3; 4 0.95,1.3; 5 -0.95,1.3
A5F083 = smd 3.81 x 3.81 bottom: P$1 -8.89,0; P$2 8.89,0 | hole 6.604: 0,0 | hole 2.54: -8.89,0; 8.89,0
IN4148 = smd 1.676 x 0.813: P$1 1.829,0; P$2 -1.829,0
TO220 = drill 1.397 pad 2.032 square: P$1 -2.54,0 | drill 1.27 pad 2.032: P$2 0,0; P$3 2.54,0
FIDUCIAL_1MM = smd 1 x 1: 1 0,0
CJV23 = smd 3.5 x 10.16 bottom: P$1 -7.366,0; P$2 7.366,0
2SMPP-03 = smd 2.286 x 0.61 bottom: P$1 4.445,1.27; P$2 4.445,0; P$3 4.445,-1.27; P$4 -4.445,-1.27; P$5 -4.445,0; P$6 -4.445,1.27 | hole 4.064: 0,0

### Placement (x,y rotation side)
ARDUINO_NANO1  53.34,73.51 270 top
C1  29.84,54.97 90 top
C2  11.43,54.97 90 top
C3  66.04,54.97 270 top
C4  40.01,54.97 90 top
C5  37.47,79.73 90 top
C6  93.73,59.03 180 top
C7  82.55,96.37 270 top
C8  74.93,96.37 270 top
C9  64.26,95.86 270 top
C10  37.08,67.41 270 top
C11  95.12,64.74 270 top
C15  72.39,36.2 0 top
C16  8.89,37.47 90 top
C17  24,34.29 90 top
C18  67.94,38.73 90 top
C19  90.81,36.83 180 top
D1  17.14,86.21 0 top
D2  78.74,86.84 180 top
D6  55.88,5.71 90 top
D7  23.5,5.71 90 top
D8  87.63,5.71 90 top
IC2  62.23,36.78 270 top
IC4  32.38,34.29 180 top
J1  35.56,93.83 270 top
J2  90.81,90.02 270 top
J3  88.9,56.87 180 top
J5  6.99,90.02 270 top
J7  88.9,42.04 180 top
J8  8.89,42.04 0 top
LED1  71.12,93.19 90 top
LED2  78.74,93.19 90 top
LED3  86.36,93.19 90 top
Q4  41.3,3.78 0 top
Q5  9.55,3.78 0 top
Q6  73.69,3.78 0 top
R1  42.8,76.68 270 top
R2  63.12,91.29 90 top
R3  21.21,86.21 0 top
R4  74.93,86.84 180 top
R5  91.44,69.57 0 top
R6  89.53,64.87 270 top
R7  37.34,59.28 180 top
R8  34.16,61.06 90 top
R17  38.73,6.35 270 top
R20  6.99,6.35 270 top
R25  71.12,6.35 270 top
R26  58.42,5.66 270 top
R27  26.04,5.66 270 top
R28  90.17,5.71 90 top
R29  29.21,39.37 0 top
R30  32.99,39.34 0 top
R31  38.73,34.24 180 top
R32  38.73,36.78 180 top
R33  34.29,27.3 270 top
R34  26.92,34.29 90 top
R35  38.73,31.7 180 top
R36  30.48,27.3 90 top
R37  62.23,40.59 180 top
R38  56.52,1.9 180 top
R39  24.13,1.9 180 top
R40  69.85,1.85 0 top
S1  13.97,93.95 90 top
S2  21.59,93.95 90 top
S3  49.28,4.55 180 top
S4  16.76,4.55 180 top
S5  81.28,4.55 180 top
U1  37.47,62.33 0 top
U2  92.46,64.62 180 top
U$1  22.86,71.48 0 top
U$2  76.2,71.48 0 top
U$3  22.23,56.87 180 top
U$4  84.2,84.81 180 top
U$5  65.41,87.73 270 top
U$6  41.27,69.57 270 top
U$9  93.98,8.23 0 top
U$10  6.35,92.68 0 top
U$11  6.35,92.68 0 bottom
U$12  93.98,8.23 0 bottom
U$17  48.9,20.95 0 top
U$18  16.51,20.95 0 top
U$19  81.28,20.95 0 top
U$20  38.1,9.47 180 top
U$21  5.71,9.47 180 top
U$22  70.48,9.47 180 top
U$23  50.16,38.1 180 top

### Tracks (layer width: path | path; a pad name or v marks a point on that pad's centre or on a via)
BTN1
  Top 0.406: ARDUINO_NANO1.20 57.02,68.43 55.37,70.08 55.37,84.65 55.44,84.72 55.44,85.41 55.37,85.48 55.37,86.84 54.86,87.35 45.21,87.35 43.03,89.53 38.44,89.53 36.49,91.49 34.63,91.49 32.68,89.53 28.49,89.53 28.34,89.38 20.32,89.38 19.68,90.02 S2.1
BTN2
  Top 0.406: ARDUINO_NANO1.21 56.52,70.97 55.98,71.5 55.98,84.4 56.05,84.47 56.05,87.03 52.93,90.14 38.7,90.14 37.8,91.04 37.8,94.75 36.49,96.06 34.63,96.06 33.33,94.75 33.33,91.04 32.68,90.4 24.45,90.4 24.04,89.99 21.74,89.99 21.34,90.4 21.34,91.41 20.32,92.43 12.7,92.43 12.06,91.8 S1.1
GND  (via drill 0.35 pad 0.85)
  Top 0.203: 92.46,61.19 93.34,60.3 94.61,60.3 95.53,59.39 C6.- | R5.1 91.23,68.93 91.23,67.59 91.8,67.03 91.99,67.03 92.46,66.56 U2.2 | 37.47,61.57 U1.2 37.47,60.64 | C1.- 35.07,53.17 arc-90 v35.56,52.68
  Top 0.305: C11.1 95.12,66.14 94.61,66.65 94.61,69.82 92.2,72.24 J2.8 | U1.2 37.47,60.9 | R31.1 41.88,34.24 v41.91,34.26
  Top 0.406: 11.75,4.04 v12.19,4.04 | Q4.2 44.7,2.78 v44.7,4.04 | Q6.2 75.93,2.78 76.2,2.51 v76.2,4.55
  Top 0.508: C18.2 66.92,40.61 v66.04,40.61 | LED2.3-GND 77.05,90.78 | U1.2 37.47,60.01 R7.1 | C8.2 75.18,95.26 v75.18,93.45 | C7.2 82.8,95.26 v82.8,93.45 | U2.2 92.46,67.54
  Top 0.61: R5.1 90.59,72.02 J2.8
  Top 0.813: J8.8 J7.8 | C1.- 35.07,53.17 | J1.GND 29.86,93.95 v26.67,93.95
  Top 1.016: C17.2 24.13,35.27 v24.13,37.44 | 8.89,32.36 8.89,35.46 C16.- 9.09,33.05 v9.14,32.99 | 32.73,68.26 31.75,67.28
  Bottom 0.203: 36.83,53.95 arc90 v35.56,52.68 36.83,52.68 arc90 37.47,53.31
  Bottom 1.016: J5.8 6.99,50.24 7.04,50.19 7.04,48.57 6.99,48.52 6.99,35.53 7.62,34.9 8.89,34.9 8.89,33.25 v9.14,32.99
  other vias: 27.94,29.18
  pour Top: -1.27,-1.3 99.06,-1.3 99.06,100.3 -1.27,100.3
  pour Bottom: -2.54,-2.57 100.33,-2.57 100.33,100.3 69.85,100.3 -2.54,100.3
N$2
  Top 0.61: U$6.P$1 41.27,74.31 R1.2
N$5  (via drill 0.35, 0.35 pad 0.85)
  Top 0.406: R3.2 22.06,79.52 v22.35,79.22
  Top 0.508: 25.78,56.87 v26.04,57.12
  Top 1.016: U$3.P$2 25.78,56.87
  Bottom 0.406: U$1.P$2 24,79.22 v22.35,79.22
  Bottom 0.508: 26.04,65.76 U$1.P$2 38.73,71.48
  Bottom 1.016: v26.04,57.12 26.04,65.76 U$1.P$2 38.73,71.48 | U$6.P$2 40.64,69.57 39.24,70.97 | 39.24,70.97 38.73,71.48 | 38.73,71.48 39.24,70.97
N$6  (via drill 0.35 pad 0.85)
  Top 1.016: U$5.P$2 73.19,87.73 R4.2 74.52,87.28 74.52,87.64 74.94,88.05 82.79,88.05 U$4.P$2 | U$4.P$2 86.03,81.25 | v85.09,76.17 85.09,80.31 | 85.09,80.31 86.03,81.25 | U$4.P$2 86.03,81.25 | 86.03,81.25 85.09,80.31
  Bottom 1.016: U$2.P$2 v85.09,76.17
N$7
  Top 0.508: U$5.P$1 65.41,92.05 65.32,92.14 R2.2
N$12
  Top 0.203: D1.C R3.1
N$17
  Top 0.203: R4.1 D2.C
N$21
  Top 0.508: LED2.2-DOUT 80.05,92.68 81.28,92.68 81.92,92.05 81.92,89.51 82.41,89.02 87.14,89.02 88.01,89.89 LED3.4-DIN
N$26
  Top 0.508: LED2.4-DIN 80.39,89.89 80.33,89.83 80.33,89.51 80.33,89.34 80.01,89.02 75.42,89.02 74.3,90.14 74.3,92.05 73.66,92.68 72.43,92.68 71.79,93.32 69.85,93.32 69.47,93.7 LED1.2-DOUT
N$54
  Top 0.406: Q4.1 41.54,3.97 41.81,3.97 42.22,4.37 42.22,4.65 43.13,5.56 51.18,5.56 S3.3
  Top 1.016: Q4.1 39.1,2.78 38.73,3.15 R17.2
N$55
  Top 0.305: Q5.1 8.6,2.86 9.53,3.78 10.16,3.78
  Top 0.406: S4.3 19.05,6.45 18.26,5.66 12.7,5.66 12.04,5.66 10.16,3.78
  Top 1.016: Q5.1 7.99,2.78 6.99,3.78 R20.2
N$56
  Top 0.305: Q6.1 71.12,4.4 R25.2
  Top 0.406: Q6.1 73.21,2.78 74.6,4.17 74.6,5.99 76.2,7.59 82.93,7.59 S5.3
  Top 1.016: Q6.1 71.12,4.4 R25.2
N$57  (via drill 0.35 pad 1)
  Top 1.016: Q6.3 73.69,8.1 U$22.P$2 88.92,9.47 v90.17,8.23 R28.2
  Bottom 0.305: 88.9,9.5 U$19.P$2
  Bottom 1.016: v90.17,8.23 88.9,9.5 U$19.P$2
N$58  (via drill 0.35 pad 0.85, 0.35 pad 1)
  Top 1.016: Q5.3 9.55,5.05 v9.55,6.32 9.55,8.84 8.91,9.47 U$21.P$2 | v27.94,5.05 27.7,4.81 R27.2
  Bottom 1.016: 24.13,6.83 U$18.P$2 | v27.94,5.05 25.91,5.05 24.13,6.83 | v9.55,6.32 10.06,6.83 24.13,6.83
N$59  (via drill 0.35 pad 0.85, 0.35 pad 1)
  Top 0.305: v59.69,5.05 59.45,4.81 R26.2
  Top 1.016: U$20.P$2 v41.3,8.1 Q4.3
  Bottom 0.305: U$17.P$2 59.38,18.08 59.69,17.78
  Bottom 1.016: U$17.P$2 59.38,18.08 59.69,17.78 59.69,8.23 | 59.69,8.23 v59.69,5.05 | v41.3,8.1 41.43,8.23 59.69,8.23
N$65
  Top 0.406: R28.1 89.98,5.05 89.76,5.05 88.22,6.59 D8.C
N$66
  Top 1.016: R27.1 25.96,6.59 D7.C
N$67
  Top 0.406: D6.C 55.96,6.51 R26.1
N$68  (via drill 0.35 pad 0.85)
  Top 0.254: IC2.2 59.59,37.44 58.42,37.44 57.78,38.07 57.78,39.98 v58.42,40.61
  Bottom 0.254: v58.42,40.61 57.15,39.34 | 57.15,39.34
  Bottom 0.305: 57.15,39.34 56.11,38.3 56.11,35.93 54.93,34.75 48.98,34.75 46.91,36.83 U$23.P$1
N$69  (via drill 0.35 pad 0.85)
  Top 0.305: v54.61,35.53 52.13,35.53 51.49,34.9 48.84,34.9 48.2,35.53 43.18,35.53
  Top 0.406: IC4.1 35.48,38.07 41.27,38.07 41.91,37.44 41.91,36.17 42.55,35.53 43.18,35.53
  Bottom 0.254: U$23.P$5 U$23.P$6
  Bottom 0.305: v54.61,35.53 U$23.P$6
N$70  (via drill 0.35 pad 0.85)
  Top 0.254: v56.52,40.61 57.15,39.98 57.15,36.8 57.81,36.14 IC2.3
  Bottom 0.305: U$23.P$4 54.61,39.98 55.24,40.61 v56.52,40.61
N$71
  Top 0.254: R29.2 31.75,37.68 IC4.3 31.75,35.14 R34.2
N$72
  Top 0.254: R37.1 64.85,38.82 IC2.8
N$73
  Top 0.254: R37.2 59.61,38.82 IC2.1
N$74
  Top 0.254: IC4.6 31.75,28.55 | 31.75,28.55 31.36,28.15 R36.2 | R33.2 33.21,26.45 31.75,27.91 31.75,28.55
  Top 0.305: IC4.6 31.75,32.99 32.38,33.63 35.56,33.63 36.2,33.63 36.2,33.39 36.39,33.19 R35.2
N$75
  Top 0.254: IC4.5 30.48,32.99 | 31.11,34.26 37.86,34.26 R31.2
  Top 0.305: 30.48,32.99 30.48,33.63 31.11,34.26
  Top 0.406: R32.1 39.59,35.75 39.37,35.53 38.1,35.53 37.88,35.32 R31.2
N$76  (via drill 0.35 pad 0.85)
  Top 0.254: IC4.2 33.02,38.52 R30.2 v36.2,39.34
  Bottom 0.254: U$23.P$3 36.22,39.37 v36.2,39.34
N$77
  Top 0.305: IC2.6 64.24,35.53 63.59,35.53 62.17,34.11 46.16,34.11 43.74,31.7 R35.1
N$78
  Top 0.406: S3.1 52.81,1.9 R38.2
N$79
  Top 0.406: R39.2 20.3,1.9 S4.1
N$80
  Top 0.406: R40.2 83.29,1.85 S5.1
NEOPIXEL  (via drill 0.35 pad 0.85)
  Top 0.508: LED1.4-DIN 71.29,92.22 68.92,92.22 v67.31,93.83
  Bottom 0.508: ARDUINO_NANO1.30 v67.31,93.83
PRESSURE0  (via drill 0.35 pad 0.85)
  Top 0.254: IC4.7 33.02,28.55 33.41,28.15 R33.1 | 78.74,36.17 78.74,41.88 J7.5
  Top 0.305: J7.5 78.74,42.52 78.74,43.79 | 78.11,44.58 19.68,44.58 19.05,43.94 J8.5
  Top 0.406: v49.53,70.46 v49.53,63.47 | J8.5 19.05,26.01 19.68,25.37 23.07,25.37 23.31,25.62 24.44,25.62 24.68,25.37 35.56,25.37 36.2,26.01 36.2,27.28 35.56,27.91 | 78.74,42.52 78.74,36.17 76.12,33.55 46.39,33.55 43.63,30.79 37.17,30.79 36.2,29.82 36.2,28.55 | J7.5 78.74,43.79 78.74,43.89 78.11,44.53 | R33.1 35.32,28.15 35.56,27.91 | 35.56,27.91 36.2,28.55 | 36.2,28.55
  Bottom 0.406: ARDUINO_NANO1.7 47.12,78.59 49.53,76.17 v49.53,70.46 | v49.53,63.47 49.53,60.93 50.8,59.66 76.96,59.66 78.74,57.89 J3.5 J7.5
PRESSURE1  (via drill 0.35 pad 0.85)
  Top 0.406: v48.26,79.86 v53.34,79.86
  Bottom 0.406: ARDUINO_NANO1.6 46.99,79.86 v48.26,79.86 | J2.5 v53.34,79.86
PRESSURE2
  Bottom 0.406: J5.5 10.44,83.31 41.12,83.31 43.18,81.25 43.18,74.27 43.94,73.51 ARDUINO_NANO1.9
PRESSURE_SENSE_1  (via drill 0.35 pad 0.85)
  Top 0.406: 82.49,67.86 v82.55,67.92
  Top 0.508: 82.49,67.86 81.53,66.9 74.31,66.9 73.89,67.32 55.59,67.32 v54.86,68.05
  Top 0.61: R5.2 93.41,68.45 v93.41,67.92 U2.1
  Bottom 0.406: v93.41,67.92 v82.55,67.92
  Bottom 0.508: ARDUINO_NANO1.11 54.48,68.43 v54.86,68.05
PUMP0  (via drill 0.35 pad 0.85)
  Top 0.61: R1.1 42.8,84.05 43.81,85.06 45.22,85.06 45.24,85.05 46.2,85.05 46.22,85.06 v54.61,85.06
  Bottom 0.61: v54.61,85.06 58.67,85.06 59.44,85.83 59.44,88.24 59.94,88.75 ARDUINO_NANO1.28
PUMP1
  Top 0.508: R2.1 61.81,90.44 ARDUINO_NANO1.29
PUMP_0_  (via drill 0.35 pad 0.85)
  Top 0.203: R8.2 33.91,62.46 33.66,62.2 34.29,62.2
  Top 0.406: U1.4 36.99,62.2 34.29,62.2 | D1.A 16.27,78.73 v16.26,78.71
  Top 1.016: U$3.P$1 20.4,57.76 20.32,57.84 v20.32,62.2 20.58,62.46 R8.2
  Bottom 0.406: U$1.P$1 16.26,73.76 v16.26,78.71
  Bottom 0.508: U$1.P$1 17.78,67.67
  Bottom 1.016: 17.78,67.67 U$1.P$1 20.32,65.13 v20.32,62.2
PUMP_1_  (via drill 0.35 pad 0.85)
  Top 0.203: 89.92,63.47 R6.2
  Top 0.508: U$4.P$1 80.34,86.84 D2.A | U2.4 91.35,63.47 89.92,63.47
  Top 1.016: U$4.P$1 82.55,84.63 82.55,78.71 81.79,77.95 73.53,77.95 v71.12,75.54 | v73.91,63.35 74.04,63.47 R6.2
  Bottom 1.016: v71.12,75.54 71.12,73.63 68.96,71.48 U$2.P$1 68.71,71.48 71.12,69.06 71.12,66.14 v73.91,63.35
PUMP_SENSE_0  (via drill 0.35 pad 0.85)
  Top 0.305: 36.38,59.18 R7.2
  Top 0.508: U1.1 36.52,59.31 36.38,59.18 36.38,58.21 v36.83,57.76
  Bottom 0.508: ARDUINO_NANO1.10 45.21,70.97 43.81,69.57 43.81,58.39 43.18,57.76 v36.83,57.76
VALVE00
  Top 0.305: 86.36,24.1 J7.2 86.36,45.69 85.95,46.1 11.84,46.1 11.43,45.69 J8.2
  Top 1.016: R25.1 71.12,8.42 70.76,8.77 70.76,10.18 71.28,10.69 74.21,10.69 74.28,10.77 85.72,10.77 86.36,11.4 86.36,24.1 J7.2
  Bottom 0.406: ARDUINO_NANO1.24 61.57,78.59 63.7,76.45 63.7,61.85 63.98,61.57 81.66,61.57 J3.2 85.09,55.85 85.09,43.15 J7.2
VALVE01
  Top 0.305: 13.97,30.45 13.97,41.88 J8.3 13.97,45.06 14.5,45.59 83.29,45.59 83.82,45.06 J7.3
  Top 1.016: J8.3 13.97,30.45 13.97,11.4 13.26,10.69 11.18,10.69 6.51,10.69 5.59,9.77 5.59,8.6 R20.1
  Bottom 0.406: J7.3 83.82,41.88 84.45,42.52 84.45,55.85 83.82,56.49 J3.3 79.76,60.93 63.4,60.93 63.09,61.24 63.09,73.91 ARDUINO_NANO1.23
VALVE02  (via drill 0.35 pad 0.85)
  Top 0.305: 16.51,41.88 J8.4 16.51,44.45 17.14,45.08 80.62,45.08 81.43,44.27 81.43,41.88
  Top 1.016: v33.02,7.59 33.41,7.2 R17.1 | 16.51,35.53 | 16.51,35.53 16.51,12.04 17.78,10.77 v29.21,10.77 | 16.51,35.53 J8.4 | J7.4 81.43,41.88
  Bottom 0.406: ARDUINO_NANO1.22 61.59,73.51 61.92,73.18 62.48,72.62 62.48,60.93 63.09,60.32 73.46,60.32 77.83,60.32 J3.4 79.38,54.97 79.38,43.94 J7.4
  Bottom 1.016: v33.02,7.59 33.02,9.5 31.75,10.77 v29.21,10.77
VALVE10
  Bottom 0.406: J2.2 90.23,86.91 88.84,86.91 88.27,86.33 88.27,83.79 87.63,83.16 64.14,83.16 63.19,84.1 63.19,85.39 62.38,86.21 ARDUINO_NANO1.27
VALVE11
  Bottom 0.406: ARDUINO_NANO1.26 62.74,81.89 87.76,81.89 J2.3
VALVE12
  Bottom 0.406: ARDUINO_NANO1.25 89.53,81.13 J2.4
VALVE20
  Bottom 0.305: 7.24,87.22 J5.2
  Bottom 0.406: ARDUINO_NANO1.4 45.21,85.7 22.35,85.7 8.76,85.7 7.24,87.22
VALVE21
  Bottom 0.406: J5.3 42.04,84.94 43.81,83.16 45.21,83.16 ARDUINO_NANO1.5
VALVE22
  Bottom 0.305: 7.05,82.46 J5.4
  Bottom 0.406: ARDUINO_NANO1.8 45.28,76.49 44.45,76.49 43.79,77.15 43.79,81.91 41.79,83.92 8.51,83.92 7.05,82.46
VCC  (via drill 0.35 pad 0.85, 0.35 pad 1)
  Top 0.203: 95.1,63.88 C11.2 | 80.39,95.86 LED2.1-VDD
  Top 0.254: C17.1 R34.1 26.92,32.11 v27.3,31.72 | IC4.8 36.16,31.69 v36.2,31.72 | v36.2,36.8 37.86,36.8 R32.2 | IC2.5 73.17,34.87 C15.+
  Top 0.508: C7.1 82.46,97.13 | 80.64,97.22 C8.1 74.84,97.13 73.66,97.13 73.03,97.13 | 80.64,97.22 C7.1 | C7.1 87.88,97.22 | 87.88,97.22 88.27,97.22 | 80.64,97.22 80.39,96.96 LED2.1-VDD | LED1.1-VDD 72.77,96.87 73.03,97.13 | 37.08,66.01 C10.2 | C9.1 64.68,97.13 73.03,97.13 | 87.88,97.22 89.7,97.22 90.42,96.49 90.42,93.95 91.95,92.43 92.46,91.92 93.98,91.92 95.5,91.92 96.19,91.24 96.19,73.13 | U2.5 93.96,63.88 95.1,63.88 | LED3.1-VDD 88.01,97.09 87.88,97.22
  Top 0.61: C11.2 95.77,64.54 95.83,64.54 96.19,64.89 96.19,67.92 | U1.5 37.08,64.2 37.08,64.74 37.08,65
  Top 0.813: C15.+ 74.29,41.41 J7.7 | C4.+ 46.35,56.87 | 46.35,56.87 46.73,56.87 47.62,57.76 47.62,65.38 47.12,65.89 ARDUINO_NANO1.12 44.58,64.74 39.04,64.74 38.94,64.84 37.89,64.84 37.79,64.74 37.34,64.74 37.08,65 | 46.35,56.87 63.65,56.87 65.26,58.48 71.71,58.48 71.79,58.39 73.66,58.39 | v16.15,66.17 36.69,66.17 C10.2 37.08,64.74
  Top 1.016: J8.7 22.23,40.13 22.23,34.26 23.05,33.44 C17.1 | R39.1 27.91,1.9 v27.94,1.88 | R38.1 57.39,1.88 v60.96,1.88 68.97,1.88 R40.1 | J2.7 95.38,74.78 96.19,73.96 96.19,73.13 96.19,67.92 | J3.7 73.66,58.39 73.66,60.3 75.56,62.2 88.1,62.2 88.34,61.96 92.03,61.96 92.27,62.2 93.34,62.2 93.41,62.27 U2.5 | v2.54,29.44 3.81,30.71 11.18,30.71 v11.43,30.45
  Bottom 0.254: v36.2,36.8 v36.2,31.72 v27.3,31.72
  Bottom 0.813: J8.7 25.88,43.79 71.91,43.79 J7.7 73.25,41.63
  Bottom 1.016: v60.96,1.88 v27.94,1.88 9.78,1.88 6.86,4.8 6.86,5.07 5.07,6.86 4.88,6.86 1.6,10.13 1.6,28.42 1.6,28.5 v2.54,29.44 | J8.7 24.13,41.38 22.35,39.6 22.35,31.98 21.08,30.71 12.45,30.71 12.19,30.45 v11.43,30.45 | J3.7 73.66,54.58 74.93,53.31 76.83,53.31 77.83,52.32 77.83,45.69 76.56,44.42 74.93,44.42 73.66,43.15 J7.7 | J5.7 9.02,74.78 11.18,72.62 11.18,70.32 11.28,70.22 11.28,67.34 12.45,66.17 v16.15,66.17
VIN  (via drill 0.35, 0.35 pad 0.85, 0.35 pad 1)
  Top 0.203: 89.6,66.21 R6.1
  Top 0.254: 67.47,37.41 IC2.7
  Top 0.305: J7.1 C19.+
  Top 0.406: D6.A 54.36,6.36 54.36,12.04 | C18.1 67.47,37.41
  Top 0.508: 41.26,93.45 J1.VIN0 | 90.23,89.45 90.55,89.76 J2.1 | ARDUINO_NANO1.15 45.53,58.45 42.3,58.45 40.01,60.75 38.7,60.75 U1.3 | U2.3 91.22,66.21 89.6,66.21
  Top 0.61: 90.23,89.45 90.55,89.76
  Top 0.813: v67.94,27.91 v62.23,27.91
  Top 1.016: U$22.P$1 68.66,11.48 v69.22,12.04 54.36,12.04 38.1,12.04 | 40.64,12.04 38.1,12.04 | 38.1,12.04 v36.2,12.04 36.2,9.55 U$20.P$1 31.73,9.47 31.11,8.86 31.11,6.32 28.34,3.55 25.24,3.55 23.95,4.84 D7.A | v87.63,3.15 D8.A | C18.1 v67.94,36.17 | J7.1 88.9,45.69 87.63,46.96 9.65,46.96 8.89,46.2 | 34.16,57.63 R8.1 | 34.16,57.63 34.67,58.14 34.67,56.74 v34.92,56.49 | C6.+ 92.51,59.23 92.71,59.03 92.71,57.76 91.82,56.87 J3.1 88.9,56.36 88.9,53.95 88.02,53.07 C3.+ 65.59,53.31 v61.98,53.31 | C5.+ 37.66,86.84 | 37.66,86.84 37.66,87.31 | J5.1 4.95,90.02 3.81,88.87 3.81,58.39 5.34,56.87 7.62,56.87 | J2.1 90.23,89.45 90.11,89.45 87.63,86.97 87.63,72.89 87.88,72.63 87.88,70.32 87.63,70.06 87.63,67.28 | R6.1 88.64,66.27 87.63,67.28 | 34.16,57.63 34.04,57.51 33.66,57.12 30.3,57.12 C1.+ 29.59,56.87 26.04,53.31 17.14,53.31 13.59,56.87 C2.+ 7.62,56.87 | v41.27,91.29 41.27,93.43 41.26,93.45 | v38.1,88.37 38.1,88.2 37.66,87.77 37.66,86.84 | J8.1 8.89,45.19 8.89,46.2 | 7.62,56.87 7.62,50.37 7.44,50.19 7.44,47.65 8.89,46.2 | v4.57,33.5 4.57,40.61 5.99,42.04 J8.1 | U$21.P$1 3.89,11.48 4.57,12.17 8.13,12.17 8.89,12.93 v8.89,14.2 | 87.63,67.28 86.36,66.01 v86.36,65.38 | J8.1 8.89,39.56 C16.+
  Bottom 0.406: 88.9,56.49 J3.1 88.9,56.49
  Bottom 0.508: J5.1 8.26,90.02
  Bottom 1.016: 41.27,27.91 U$17.P$1 41.27,12.29 41.02,12.04 v36.2,12.04 | 73.66,27.91 v67.94,27.91 v67.94,36.17 | v62.23,27.91 41.27,27.91 | U$19.P$1 73.66,27.91 | 41.27,27.91 8.89,27.91 8.89,27.41 | 8.89,27.41 8.89,26.9 U$18.P$1 v8.89,14.2 | 73.66,27.91 85.72,27.91 88.9,31.09 J7.1 90.17,43.31 90.17,55.6 J3.1 | v34.92,56.49 43.94,56.49 ARDUINO_NANO1.15 45.72,54.33 46.74,53.31 v61.98,53.31 | 8.26,90.02 21.34,90.02 31.62,90.02 33.02,91.41 33.02,94.88 34.51,96.37 36.61,96.37 37.12,95.86 37.47,95.86 37.47,95.51 38.1,94.88 38.1,92.68 39.5,91.29 | 39.5,91.29 v41.27,91.29 39.5,91.29 | 39.5,91.29 38.1,89.89 v38.1,88.37 | 8.89,27.41 4.57,31.72 v4.57,33.5 | U$19.P$1 73.66,16.74 | 73.66,16.74 73.66,12.67 73.15,12.17 69.34,12.17 v69.22,12.04 | U$19.P$1 73.66,16.74 | U$19.P$1 73.66,17.75 74.68,16.74 78.74,16.74 80.77,14.71 80.77,4.55 82.17,3.15 v87.63,3.15 | v86.36,65.38 86.36,59.66 88.9,57.12 88.9,56.49

### Text on the board
tPlace: Vin / / V20 / / V21 / / V22 / / P2 / / / / +5 / / GND | Vin / / V20 / / V21 / / V22 / / P2 / / / / +5 / / GND | Vin / / V10 / / V11 / / V12 / / P1 / / / / +5 / / GND | Vin / / V10 / / V11 / / V12 / / P1 / / / / +5 / / GND | GND / / +5 / / / / P0 / / V02 / / V01 / / V00 / / Vin | GND / / +5 / / / / P0 / / V02 / / V01 / / V00 / / Vin | Vin / / V0 / / V1 / / V2 / / P / / / / +5 / / GND | GND / / +5 / / / / P / / V2 / / V1 / / V0 / / Vin
bPlace: Vin / / V20 / / V21 / / V22 / / P2 / / / / +5 / / GND | Vin / / V10 / / V11 / / V12 / / P1 / / / / +5 / / GND | Vin / / V00 / / V01 / / V02 / / P0 / / / / +5 / / GND | Vin / / V0 / / V1 / / V2 / / P / / / / +5 / / GND | GND / / +5 / / / / P / / V2 / / V1 / / V0 / / Vin